# Altium project ad_via_motors.PrjPcb
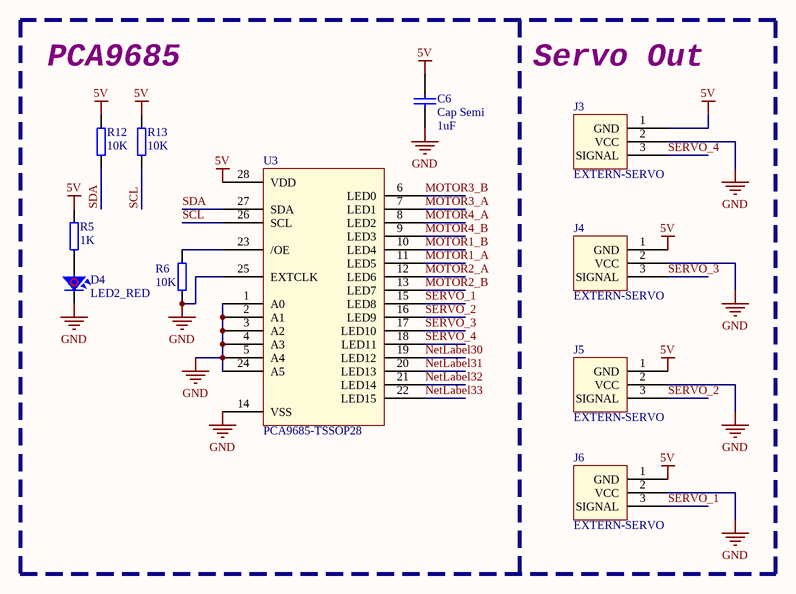
[diagram p0: VIA_MOTORS.SchDoc]
1 sheet, 11 parts. Net scope: global (net labels, ports and power ports of the same name join across sheets).
Board file: ad_motor.PcbDoc

## Sheet VIA_MOTORS.SchDoc
size A

### Parts
C6  Cap Semi  value 1uF  [SMT0603]
D4  LED2_RED  [LED_RED_SMD0603]
J3  EXTERN-SERVO  [JP3H]
J4  EXTERN-SERVO  [JP3H]
J5  EXTERN-SERVO  [JP3H]
J6  EXTERN-SERVO  [JP3H]
R5  value 1K  [SMT0603]  (hidden comment: Resistor)
R6  value 10K  [SMT0603]  (hidden comment: Resistor)
R12  value 10K  [SMT0603]  (hidden comment: Resistor)
R13  value 10K  [SMT0603]  (hidden comment: Resistor)
U3  PCA9685-TSSOP28  [TSSOP28-SMD]

### Nets
5V: C6.2 J3.1(GND) J4.1(GND) J5.1(GND) J6.1(GND) R5.2 R12.2 R13.2 U3.28(VDD)
GND: C6.1 D4.2 J3.2(VCC) J4.2(VCC) J5.2(VCC) J6.2(VCC) R6.1 U3.1(A0) U3.2(A1) U3.3(A2) U3.4(A3) U3.5(A4) U3.14(VSS) U3.24(A5) U3.25(EXTCLK)
MOTOR1_A: U3.11(LED5)
MOTOR1_B: U3.10(LED4)
MOTOR2_A: U3.12(LED6)
MOTOR2_B: U3.13(LED7)
MOTOR3_A: U3.7(LED1)
MOTOR3_B: U3.6(LED0)
MOTOR4_A: U3.8(LED2)
MOTOR4_B: U3.9(LED3)
NetLabel30: U3.19(LED12)
NetLabel31: U3.20(LED13)
NetLabel32: U3.21(LED14)
NetLabel33: U3.22(LED15)
SCL: R13.1 U3.26(SCL)
SDA: R12.1 U3.27(SDA)
SERVO_1: J6.3(SIGNAL) U3.15(LED8)
SERVO_2: J5.3(SIGNAL) U3.16(LED9)
SERVO_3: J4.3(SIGNAL) U3.17(LED10)
SERVO_4: J3.3(SIGNAL) U3.18(LED11)
NetD4_1: D4.1 R5.1
NetR6_2: R6.2 U3.23(/OE)

### Notes on the sheet
- PCA9685
- Servo Out

### Library data of the parts
C6 = CAP-SM-0603-X7R-1uF: CAP SM 0603 X7R 1uF 10%; Tolerance: ±10%; Supplier 1: Digi-Key; Supplier 2: Farnell; Supplier Part Number 1: 490-5307-1-ND; Supplier Part Number 2: 2366834
D4 = LED2_RED-0603/200mA-2V: LED RED CLEAR 0603 SMD; Manufacturer: Lite-On Inc.; Manufacturer Part Number: LTST-C191KRKT; Lens Color: Colorless; Millicandela Rating: 54mcd; Lens Style/Size: Rectangle with Flat Top, 1.10mm x 0.80mm; Voltage - Forward (Vf) (Typ): 2V; Current - Test: 20mA; Viewing Angle: 130°; Wavelength - Dominant: 631nm; Wavelength - Peak: 639nm; Value: L_RED; /NUM: 6; Supplier 1: Digi-Key; RoHS: RoHS Compliant; Category: Optoelectronics; Stock 1: 680000; Pricing 1: 5000=0.0404, 10000=0.03636, 25000=0.03232, 50000=0.02929, 125000=0.02727 (USD); Packaging: Tape & Reel (TR); Part Status: Active; Color: Red; Lens Transparency: Clear; Mounting Type: Surface Mount; Features: -; Package / Case: 0603 (1608 Metric); Supplier Device Package: *; Size / Dimension: 1.60mm L x 0.80mm W; Height (Max): 0.55mm; ComponentLink1URL: http://optoelectronics.liteon.com/upload/download/DS22-2000-223/S_110_LTST-C191KRKT.pdf; ComponentLink1Description: http://optoelectronics.liteon.com/upload/download/DS22-2000-223/S_110_LTST-C191KRKT.pdf; Supplier Part Number 1: 160-1447-2-ND
R5 = RES-SM-0603-1K: RES SM 0603 1K
R6 R12 R13 = RES-SM-0603-10K: RES SM 0603 10K; Supplier 1: Farnell; Supplier 2: Digi-Key; Supplier Part Number 1: 9330399; Supplier Part Number 2: 541-10.0KHCT-ND